# Altium schematic sheet Power Supply (PWR).SchDoc
size A4; SheetNumber: 4; SheetTotal: 10
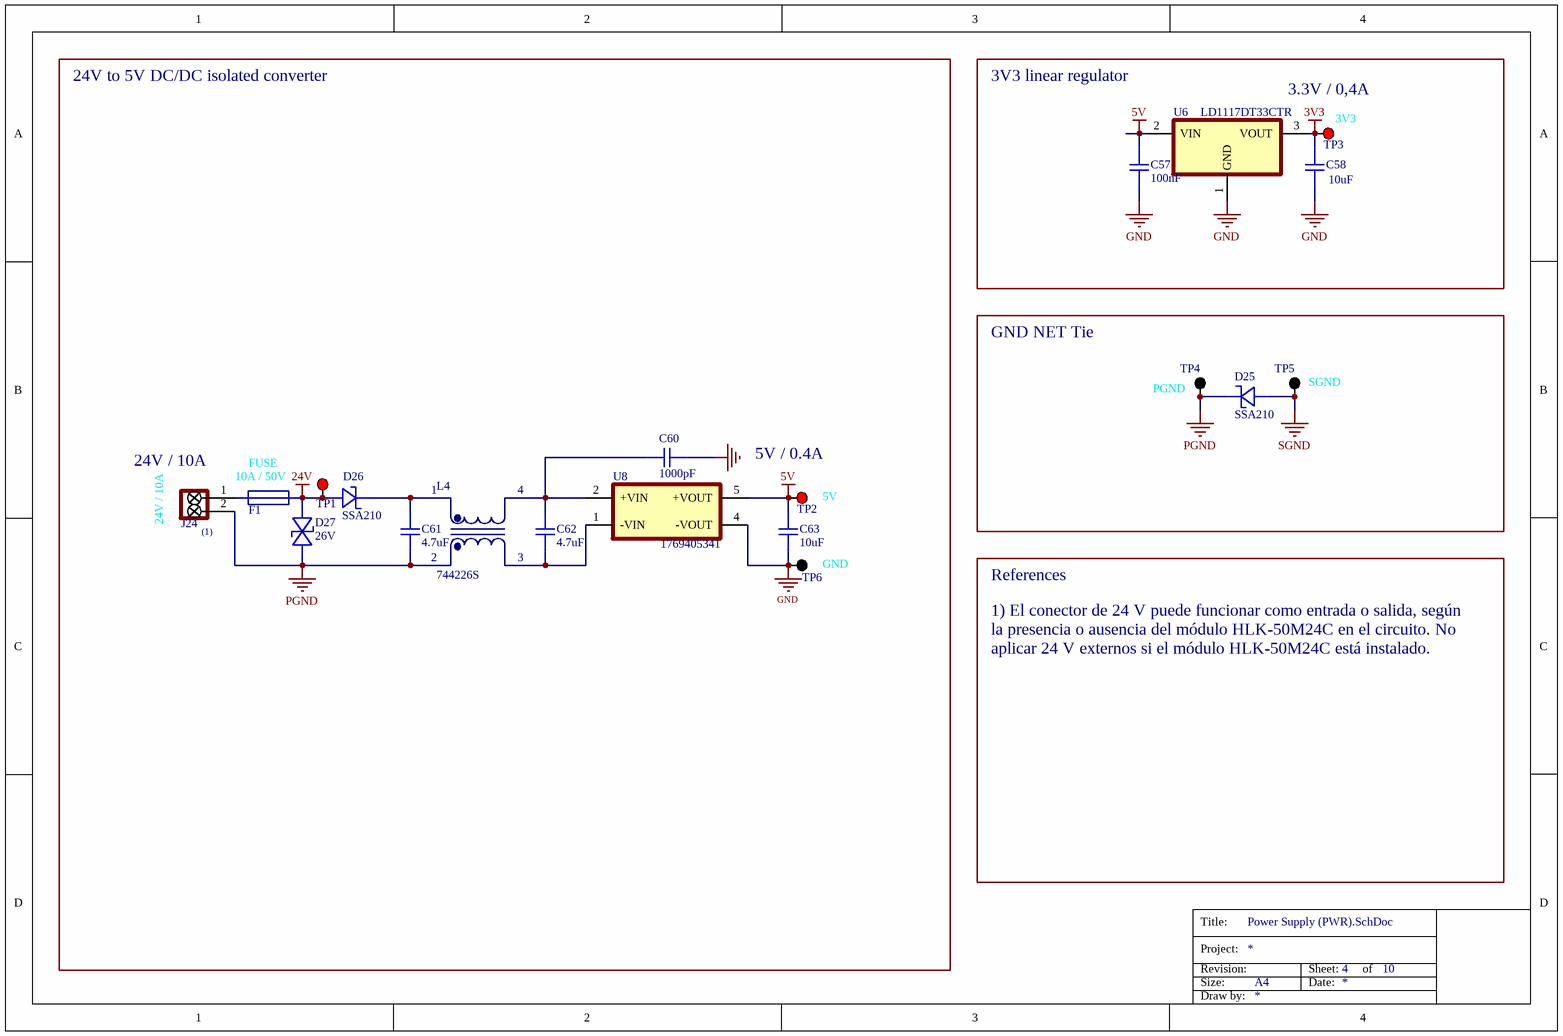
[diagram p0: Power Supply (PWR).SchDoc]

## Parts
C57  value 100nF  [CAPC1005N]  (hidden comment: Multilayer Ceramic Capacitors)
C58  value 10uF  [CAPC2012N]  (hidden comment: Multilayer Ceramic Capacitors)
C60  value 1000pF  [CAPC3216N]  (hidden comment: Multilayer Ceramic Capacitors)
C61  value 4.7uF  [CAPC2012N]  (hidden comment: Multilayer Ceramic Capacitors)
C62  value 4.7uF  [CAPC2012N]  (hidden comment: Multilayer Ceramic Capacitors)
C63  value 10uF  [CAPC2012N]  (hidden comment: Multilayer Ceramic Capacitors)
D25  Part Number: SSA210  [DIOM5026X229N]  (hidden comment: Schottky Diodes)
D26  Part Number: SSA210  [DIOM5026X229N]  (hidden comment: Schottky Diodes)
D27  value 26V  [DIOM5026X229N_NP]  (hidden comment: ESD Protection Diodes)
F1  Cartridge Fuse  [RESC3216N]  (value not drawn)
J24  Terminal Blocks  [CONB_FIX508P-2N]  (value not drawn)
L4  Part Number: 744226S  [INDC6X9.2-4N]  (hidden comment: Common Mode Chokes)
TP1  Test point  [TP-1MM]  (value not drawn)  (no BOM)
TP2  Test point  [TP-1MM]  (value not drawn)  (no BOM)
TP3  Test point  [TP-1MM]  (value not drawn)  (no BOM)
TP4  Test point  [TPH1.6D3.2BLK]  (value not drawn)
TP5  Test point  [TPH1.6D3.2BLK]  (value not drawn)
TP6  Test point  [TPH1.6D3.2BLK]  (value not drawn)
U6  Part Number: LD1117DT33CTR  [TO252P170-3N]  (hidden comment: LDO Voltage Regulators)
U8  Part Number: 1769405341  [PKG10.8X12.8-5N]  (hidden comment: Isolated DC/DC Converter)

## Blocks framed on the sheet
GND NET Tie: D25 TP4 TP5

## Nets
3V3: C58.1 TP3.1 U6.3(VOUT)
5V: C57.1 C63.1 TP2.1 U6.2(VIN) U8.5(+VOUT)
24V: D26.A D27.2 F1.2 TP1.1
GND: C57.2 C58.2 C60.2 C63.2 TP6.1 U6.1(GND) U8.4(-VOUT)
PGND: C61.2 D25.C D27.1 J24.2 L4.2 TP4.1
SGND: D25.A TP5.1
NetC60_1: C60.1 C62.1 L4.4 U8.2(+VIN)
NetC61_1: C61.1 D26.C L4.1
NetC62_2: C62.2 L4.3 U8.1(-VIN)
NetF1_1: F1.1 J24.1

## Notes on the sheet
- 24V to 5V DC/DC isolated converter
- 3V3 linear regulator
- 3.3V / 0,4A
- (near TP3) 3V3
- (near TP5) SGND
- (near TP4) PGND
- (near J24) 24V / 10A
- (near F1) 10A / 50V
- (near F1) FUSE
- 5V / 0.4A
- (near TP2) 5V
- (near J24) (1)
- (near TP6) GND
- References
- 1) El conector de 24 V puede funcionar como entrada o salida, según la presencia o ausencia del módulo HLK-50M24C en el circuito. No aplicar 24 V externos si el módulo HLK-50M24C está instalado.
- Title:
- Project:
- Revision:
- Size:
- A4
- Sheet:
- Date:
- of
- Draw by:

## Library data of the parts
C57 = C-MLCC-100nF-50V-10%-0402: Multilayer Ceramic Capacitors MLCC - SMD/SMT 50 V 0.1uF X7R 0402 10%; Part Number: CC0402KRX5R9BB104; Manufacturer: YAGEO; Mounting Type: SMT; Mouser Part #: 603-CC402KRX5R9BB104; Digikey Part #: 311-3342-1-ND; JLCPCB Part #: C105882
C58 C63 = C-MLCC-10uF-16V-10%-0805: Multilayer Ceramic Capacitors MLCC - SMD/SMT 16V 10uF X5R 0805 10%; Part Number: CC0805KKX5R7BB106; Manufacturer: YAGEO; Mounting Type: SMT; Mouser Part #: 603-CC805KKX5R7BB106; Digikey Part #: 311-1865-1-ND; JLCPCB Part #: C89827
C60 = C-MLCC-1000pF-2kV-10%-1206: Multilayer Ceramic Capacitors MLCC - SMD/SMT 2kV 1000pF X7R 1206 10%; Part Number: CC1206KKX7RDBB102; Manufacturer: YAGEO; Mounting Type: SMT; Mouser Part #: 603-CC206KKX7RDBB102; Digikey Part #: 311-1487-1-ND; JLCPCB Part #: C23631
C61 C62 = C-MLCC-4.7uF-50V-10%-0805: Multilayer Ceramic Capacitors MLCC - SMD/SMT 50V 4.7uF X5R 0805 10%; Part Number: CC0805KKX5R9BB475; Manufacturer: YAGEO; Mounting Type: SMT; Mouser Part #: 603-CC0805KKX59BB475; Digikey Part #: 13-CC0805KKX5R9BB475CT-ND; JLCPCB Part #: C2897302
D25 D26 = D-SCH-2A-100V-SMA: Schottky Diodes & Rectifiers 2A 100V SMA; Manufacturer: onsemi; Mounting Type: SMT; Mouser Part #: 512-SSA210; Digikey Part #: SSA210CT-ND; JLCPCB Part #: C14996
D27 = D-TVS-400W-26V-SMA-BI: ESD Protection Diodes / TVS Diodes 400W 26V 5% Bi-Directional; Part Number: SMAJ26CA; Manufacturer: Littelfuse; Mounting Type: SMT; Mouser Part #: 576-SMAJ26CA; Digikey Part #: 18-SMAJ26CACT-ND; JLCPCB Part #: C173517
F1 = F-1206-10A-50V-SMT: Surface Mount Fuses 1206 high-current met-foil. 10A; Manufacturer: Bourns; Part Number: SF-1206HH1000R-2; Mounting Type: SMT; Mouser Part #: 652-SF-1206HH1000R-2; Digikey Part #: 118-SF-1206HH1000R-2CT-ND; JLCPCB Part #: C136354
J24 = J-02-5P08-TERM-F-VERT-TH: Pluggable Terminal Blocks 2 Pos 5.08mm pitch Through Hole Header; Manufacturer: Adam Tech; Part Number: EBA-02-D-BU-01; Mouser Part #: 737-EBA-02-D-BU-01; Mounting Type: THT; Digikey Part #: ED2609-ND; JLCPCB Part #: C8475
L4 = L-CMC-10uH-1.6A-TH: Common Mode Chokes / Filters WE-SL2 SMD Sectional 2x10uH 1600mA; Manufacturer: Wurth Elektronik; Mounting Type: SMT; Mouser Part #: 710-744226S; Digikey Part #: 732-1476-1-ND; JLCPCB Part #: C878356
TP1-TP3 = TP-1MM-SMD: Test point, 1mm, exposed pad; Mounting Type: SMD; JLCPCB Part #: C5199810
TP4-TP6 = TP-LOOP-D3.2-P1.60-BLK-TH: Test point black, Mtg Hole 1.6, loop 3.2mm; Part Number: 5006; Manufacturer: Keystone Electronics; Mounting Type: THT; Mouser Part #: 534-5006; Digikey Part #: 36-5006-ND; JLCPCB Part #: C2906764
U6 = U-LD1117DT33CTR: LDO Voltage Regulators 3.3V 0.8A Positive; Manufacturer: STMicroelectronics; Mounting Type: SMT; Mouser Part #: 511-LD1117DT33C-TR; Digikey Part #: 497-1235-1-ND; JLCPCB Part #: C36395
U8 = U-1769405341-SMD: Isolated DC/DC Converters - SMD WPME-FISM SMT-8 Modu 24Vin 5Vout 2W 3kV; Manufacturer: Wurth Elektronik; Mounting Type: SMT; Mouser Part #: 710-1769405341; Digikey Part #: 732-1769405341CT-ND; JLCPCB Part #: C6978530